# EAGLE design traxmod-pic32-0.7.0 (EAGLE 4.09)
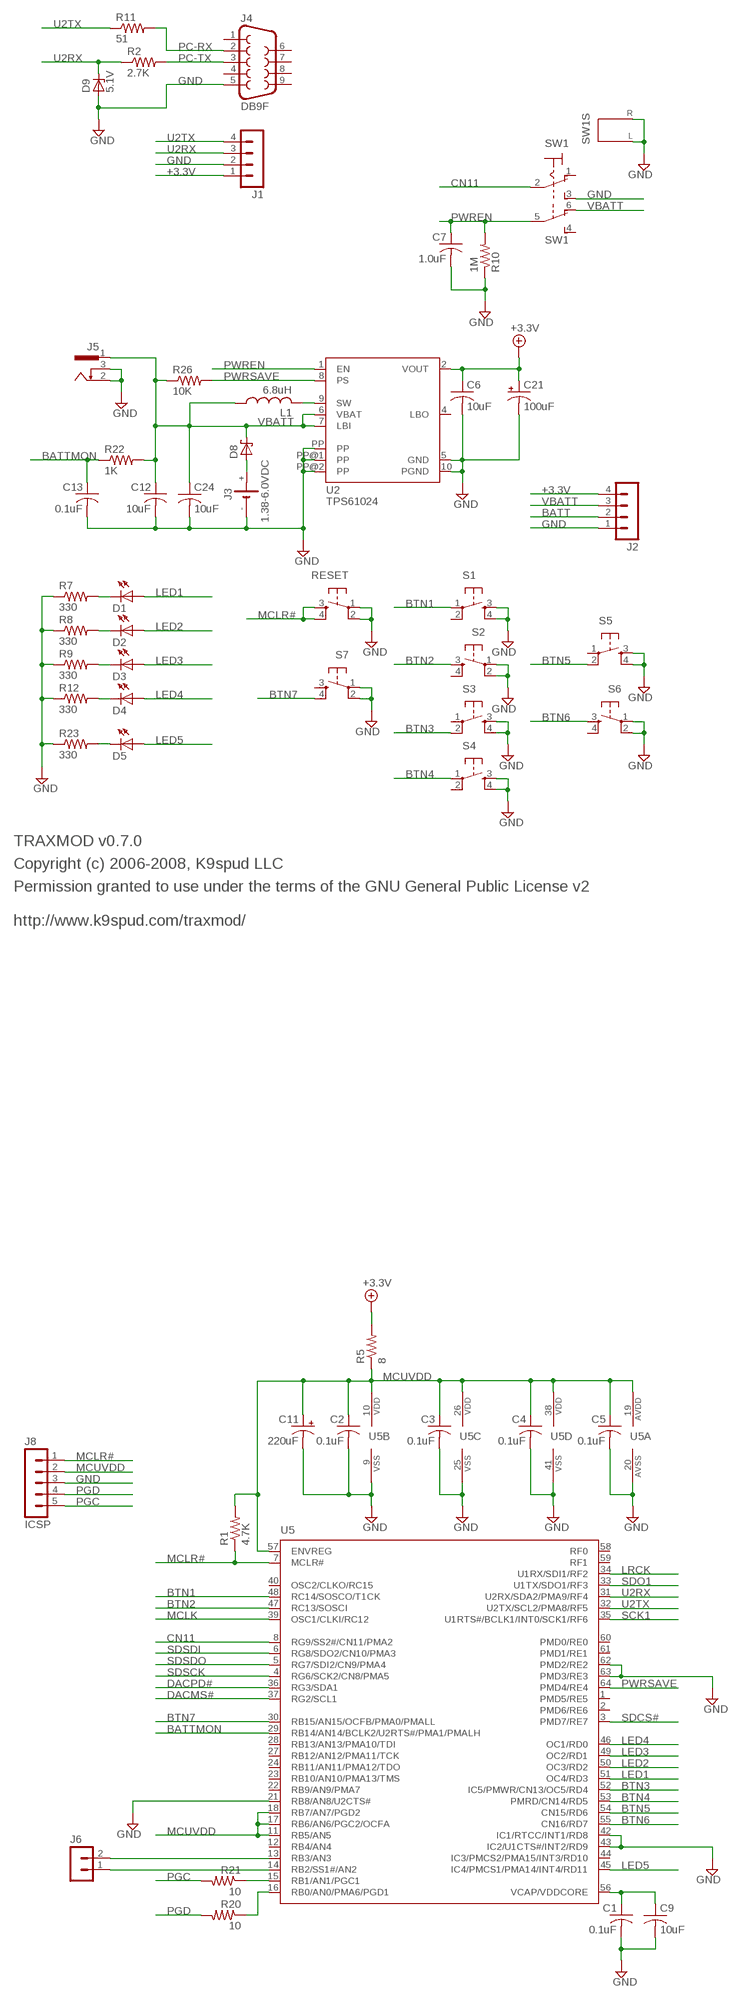
[diagram p0: schematic, sheet 1, part 1 of 2]
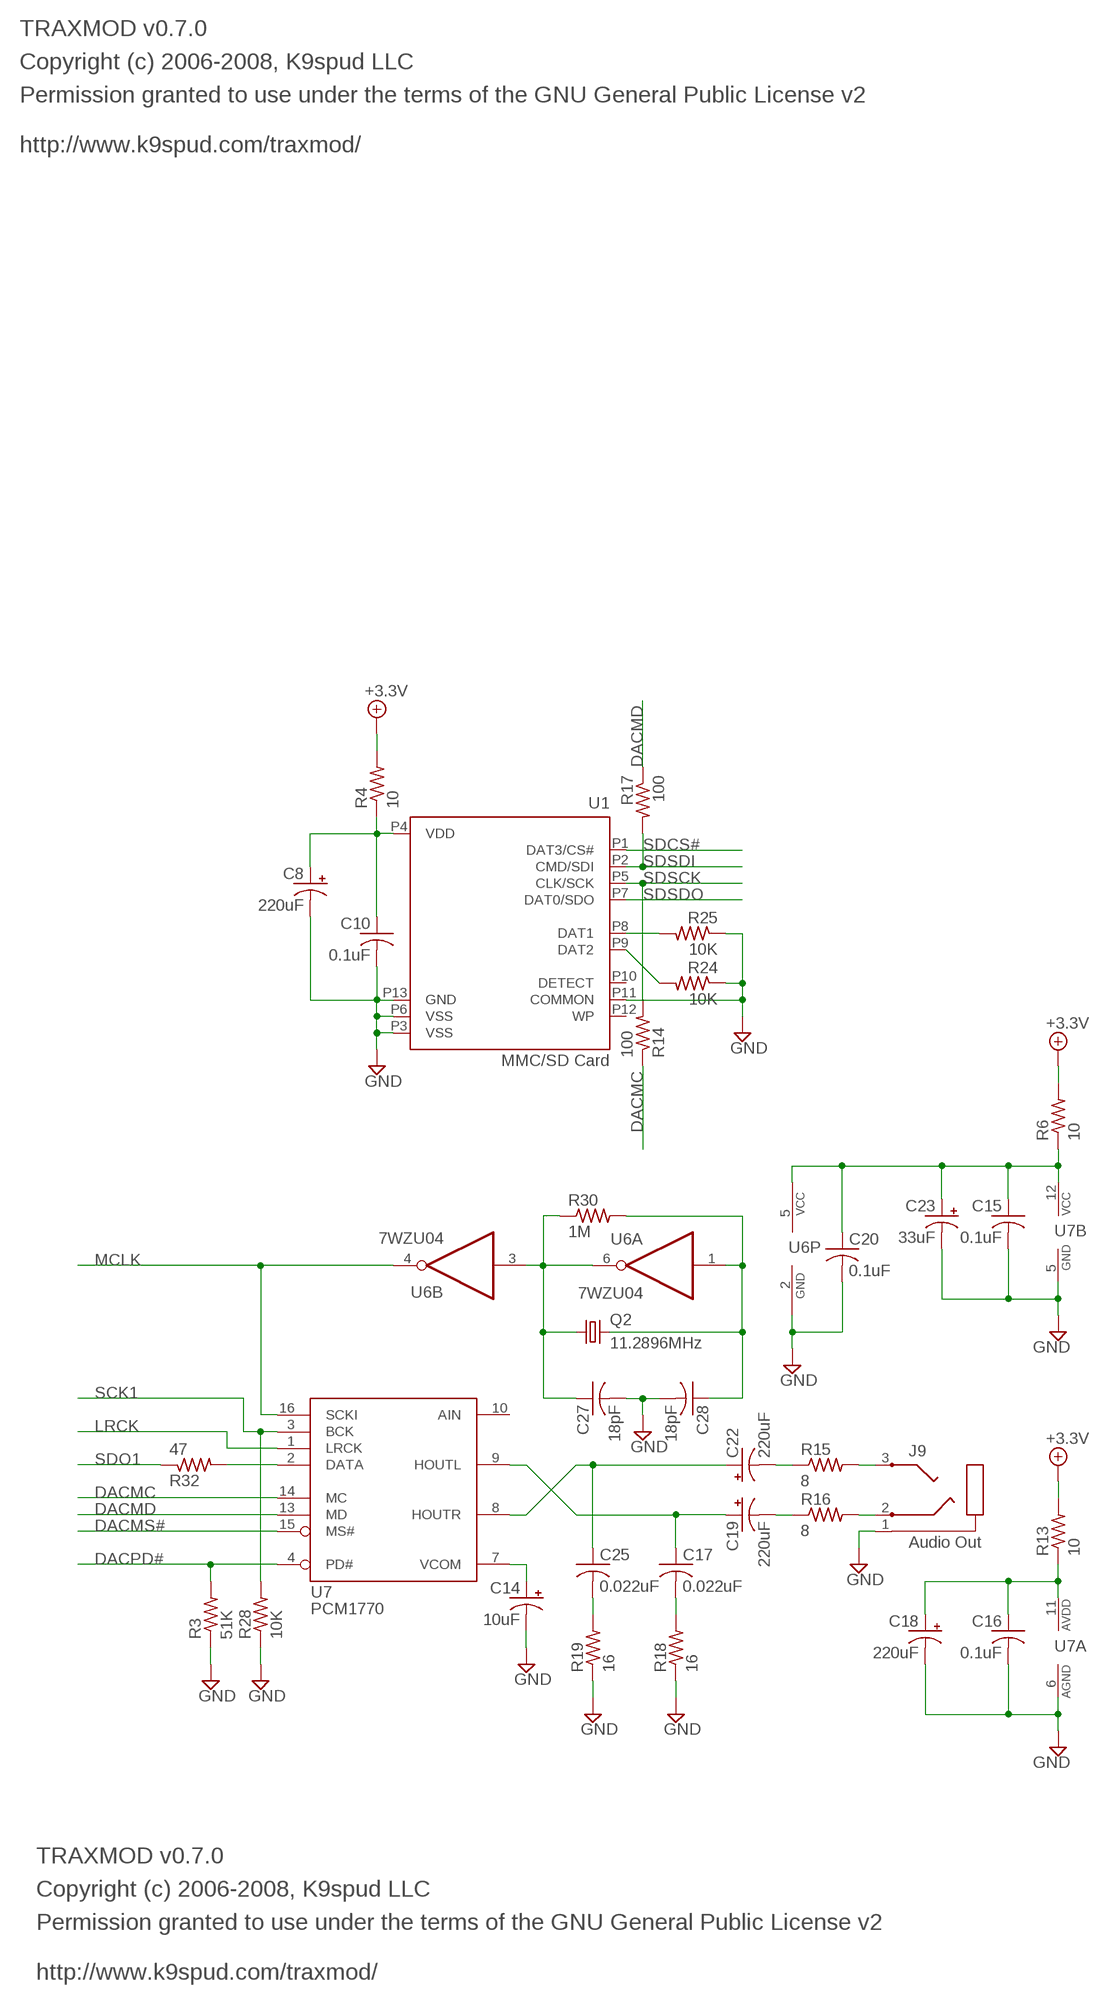
[diagram p1: schematic, sheet 1, part 2 of 2]

## Parts
C1  0.1uF  C-USC0603  [C0603]
C2  0.1uF  C-USC0603  [C0603]
C3  0.1uF  C-USC0603  [C0603]
C4  0.1uF  C-USC0603  [C0603]
C5  0.1uF  C-USC0603  [C0603]
C6  10uF  C-USC1206  [C1206]
C7  1.0uF  C-USC0603  [C0603]
C8  220uF  CPOL-USE3.5-8  [E3.5-8]
C9  10uF  C-USC1206  [C1206]
C10  0.1uF  C-USC0603  [C0603]
C11  220uF  CPOL-USE3.5-8  [E3.5-8]
C12  10uF  C-USC1206  [C1206]
C13  0.1uF  C-USC0603  [C0603]
C14  10uF  CPOL-USE2-5  [E2-5]
C15  0.1uF  C-USC0603  [C0603]
C16  0.1uF  C-USC0603  [C0603]
C17  0.022uF  C-USC0603  [C0603]
C18  220uF  CPOL-USE3.5-8  [E3.5-8]
C19  220uF  CPOL-USE3.5-8  [E3.5-8]
C20  0.1uF  C-USC0603  [C0603]
C21  100uF  CPOL-USD  [C7343]
C22  220uF  CPOL-USE3.5-8  [E3.5-8]
C23  33uF  CPOL-USE2-5  [E2-5]
C24  10uF  C-USC1206  [C1206]
C25  0.022uF  C-USC0603  [C0603]
C27  18pF  C-USC0603  [C0603]
C28  18pF  C-USC0603  [C0603]
D1  LED3MM  [LED3MM]
D2  LED3MM  [LED3MM]
D3  LED3MM  [LED3MM]
D4  LED3MM  [LED3MM]
D5  LED3MM  [LED3MM]
D8  SCHOTTKY-FYV0704S  [SOT23W]
D9  5.1V  ZENER-DIODESOD80C  [SOD80C]
J1  MA04-1S  [MA04-1S]
J2  MA04-1S  [MA04-1S]
J3  1.38-6.0VDC  12BH423  [12BH423]
J4  DB9F  F09D  [F09D]
J5  PWRJACK-1.3MM  [PWR-13MM]
J6  MA02-1S  [MA02-1S]
J8  ICSP  MA05-1S  [MA05-1S]
J9  Audio Out  3C-STEREO  [3C-3-5MM]
L1  6.8uH  L-US  [SMP3316]
Q2  11.2896MHz  CRYTALTC26H  [TC26H]
R1  4.7K  R-US_R0603  [R0603]
R2  2.7K  R-US_R0603  [R0603]
R3  51K  R-US_R0603  [R0603]
R4  10  R-US_R0603  [R0603]
R5  8  R-US_R0603  [R0603]
R6  10  R-US_R0603  [R0603]
R7  330  R-US_R0603  [R0603]
R8  330  R-US_R0603  [R0603]
R9  330  R-US_R0603  [R0603]
R10  1M  R-US_R0603  [R0603]
R11  51  R-US_R0603  [R0603]
R12  330  R-US_R0603  [R0603]
R13  10  R-US_R0603  [R0603]
R14  100  R-US_R0603  [R0603]
R15  8  R-US_R0603  [R0603]
R16  8  R-US_R0603  [R0603]
R17  100  R-US_R0603  [R0603]
R18  16  R-US_R0603  [R0603]
R19  16  R-US_R0603  [R0603]
R20  10  R-US_R0603  [R0603]
R21  10  R-US_R0603  [R0603]
R22  1K  R-US_R0603  [R0603]
R23  330  R-US_R0603  [R0603]
R24  10K  R-US_R0603  [R0603]
R25  10K  R-US_R0603  [R0603]
R26  10K  R-US_R0603  [R0603]
R28  10K  R-US_R0603  [R0603]
R30  1M  R-US_R0603  [R0603]
R32  47  R-US_R0603  [R0603]
RESET  10-XX  [6X6]
S1  10-XX  [6X6]
S2  10-XX  [6X6]
S3  10-XX  [6X6]
S4  10-XX  [6X6]
S5  10-XX  [6X6]
S6  10-XX  [6X6]
S7  10-XX  [6X6]
SW1  EG2215  [EG2215]
U1  MMC/SD Card  SCDA  [SCDA]
U2  TPS61024  TPS6102X  [QFN10]
U5  PIC32MX340  [TQFP-64]
U6  7WZU04  NC7WZU04  [SC70-6]
U7  PCM1770  [SSOP16]

## Nets
+3.3V: C6.1 C21.+ J1.1 J2.4 R4.2 R5.2 R6.2 R13.2 U2.2(VOUT)
BATT: D8.1(A) J2.2 J3.+
BATTMON: C13.1 R22.1 U5.29(RB14/AN14/BCLK2/U2RTS#/PMA1/PMALH)
BTN1: S1.1(P) U5.48(RC14/SOSCO/T1CK)
BTN2: S2.3(S) U5.47(RC13/SOSCI)
BTN3: S3.2(P1) U5.52(IC5/PMWR/CN13/OC5/RD4)
BTN4: S4.1(P) U5.53(PMRD/CN14/RD5)
BTN5: S5.2(P1) U5.54(CN15/RD6)
BTN6: S6.3(S) U5.55(CN16/RD7)
BTN7: S7.4(S1) U5.30(RB15/AN15/OCFB/PMA0/PMALL)
CN11: SW1.2(P) U5.8(RG9/SS2#/CN11/PMA2)
DACAVDD: C16.1 C18.+ R13.1 U7.11(AVDD)
DACMC: R14.1 U7.14(MC)
DACMD: R17.1 U7.13(MD)
DACMS#: U5.37(RG2/SCL1) U7.15(MS#)
DACPD#: R3.2 U5.36(RG3/SDA1) U7.4(PD#)
DACVDD: C15.1 C20.1 C23.+ R6.1 U6.5(P:VCC) U7.12(VCC)
DATA: R32.2 U7.2(DATA)
GND: C1.2 C2.2 C3.2 C4.2 C5.2 C6.2 C7.2 C8.- C9.2 C10.2 C11.- C12.2 C13.2 C14.- C15.2 C16.2 C18.- C20.2 C21.- C23.- C24.2 C27.2 C28.2 D9.A J1.2 J2.1 J3.- J4.5 J5.2 J5.3 J8.3 J9.1 R3.1 R7.1 R8.1 R9.1 R10.1 R12.1 R18.1 R19.1 R23.1 R24.1 R25.1 R28.1 RESET.1(P) RESET.2(P1) S1.3(S) S1.4(S1) S2.1(P) S2.2(P1) S3.3(S) S3.4(S1) S4.3(S) S4.4(S1) S5.3(S) S5.4(S1) S6.1(P) S6.2(P1) S7.1(P) S7.2(P1) SW1.3(S) SW1.7(S:S) SW1.8(S:S) U1.P3(VSS) U1.P6(VSS) U1.P11(COMMON) U1.P13(GND) U2.5(GND) U2.10(PGND) U2.PP U2.PP@1(PP) U2.PP@2(PP) U5.9(VSS) U5.20(AVSS) U5.21(RB8/AN8/U2CTS#) U5.25(VSS) U5.41(VSS) U5.42(IC1/RTCC/INT1/RD8) U5.43(IC2/U1CTS#/INT2/RD9) U5.62(PMD2/RE2) U5.63(PMD3/RE3) U6.2(P:GND) U7.5(GND) U7.6(AGND)
HOUTL: C22.+ C25.1 U7.8(HOUTR)
HOUTR: C17.1 C19.+ U7.9(HOUTL)
LED1: D1.A U5.51(OC4/RD3)
LED2: D2.A U5.50(OC3/RD2)
LED3: D3.A U5.49(OC2/RD1)
LED4: D4.A U5.46(OC1/RD0)
LED5: D5.A U5.45(IC4/PMCS1/PMA14/INT4/RD11)
LRCK: U5.34(U1RX/SDI1/RF2) U7.1(LRCK)
MCLK: U5.39(OSC1/CLKI/RC12) U6.4(B:O) U7.16(SCKI)
MCLR#: J8.1 R1.1 RESET.3(S) RESET.4(S1) U5.7(MCLR#)
MCUVDD: C2.1 C3.1 C4.1 C5.1 C11.+ J8.2 R1.2 R5.1 U5.10(VDD) U5.11(RB5/AN5) U5.17(RB6/AN6/PGC2/OCFA) U5.18(RB7/AN7/PGD2) U5.19(AVDD) U5.26(VDD) U5.38(VDD) U5.57(ENVREG)
N$1: D1.K(C) R7.2
N$2: D5.K(C) R23.2
N$3: D2.K(C) R8.2
N$4: D3.K(C) R9.2
N$5: L1.2 U2.9(SW)
N$6: D4.K(C) R12.2
N$8: R20.1 U5.16(RB0/AN0/PMA6/PGD1)
N$10: R21.1 U5.15(RB1/AN1/PGC1)
N$13: R24.2 U1.P9(DAT2)
N$14: R25.2 U1.P8(DAT1)
N$15: C27.1 Q2.1 R30.1 U6.3(B:I) U6.6(A:O)
N$21: C28.1 Q2.2 R30.2 U6.1(A:I)
N$28: C25.2 R19.2
N$30: C17.2 R18.2
N$31: C22.- R15.1
N$34: C19.- R16.1
N$35: J9.3 R15.2
N$36: J9.2 R16.2
PC-RX: J4.2 R11.2
PC-TX: J4.3 R2.2
PGC: J8.5 R21.2
PGD: J8.4 R20.2
PWREN: C7.1 R10.2 SW1.5(P) U2.1(EN)
PWRSAVE: R26.2 U2.8(PS) U5.64(PMD4/RE4)
RB3: J6.2 U5.13(RB3/AN3)
SCK1: R28.2 U5.35(U1RTS#/BCLK1/INT0/SCK1/RF6) U7.3(BCK)
SDCS#: U1.P1(DAT3/CS#) U5.3(PMD7/RE7)
SDO1: R32.1 U5.33(U1TX/SDO1/RF3)
SDSCK: R14.2 U1.P5(CLK/SCK) U5.4(RG6/SCK2/CN8/PMA5)
SDSDI: R17.2 U1.P2(CMD/SDI) U5.6(RG8/SDO2/CN10/PMA3)
SDSDO: U1.P7(DAT0/SDO) U5.5(RG7/SDI2/CN9/PMA4)
SDVDD: C8.+ C10.1 R4.1 U1.P4(VDD)
SS1#: J6.1 U5.14(RB2/SS1#/AN2)
U2RX: D9.C J1.3 R2.1 U5.31(U2RX/SDA2/PMA9/RF4)
U2TX: J1.4 R11.1 U5.32(U2TX/SCL2/PMA8/RF5)
VBATT: C12.1 C24.1 D8.3(C) J2.3 J5.1 L1.1 R22.2 R26.1 SW1.6(O) U2.6(VBAT) U2.7(LBI)
VCOM: C14.+ U7.7(VCOM)
VDDCORE: C1.1 C9.1 U5.56(VCAP/VDDCORE)
Unconnected: J4.1 J4.4 J4.6 J4.7 J4.8 J4.9 S1.2(P1) S2.4(S1) S3.1(P) S4.2(P1) S5.1(P) S6.4(S1) S7.3(S) SW1.1(O) SW1.4(S) U1.P10(DETECT) U1.P12(WP) U2.4(LBO) U5.1(PMD5/RE5) U5.2(PMD6/RE6) U5.12(RB4/AN4) U5.22(RB9/AN9/PMA7) U5.23(RB10/AN10/PMA13/TMS) U5.24(RB11/AN11/PMA12/TDO) U5.27(RB12/AN12/PMA11/TCK) U5.28(RB13/AN13/PMA10/TDI) U5.40(OSC2/CLKO/RC15) U5.44(IC3/PMCS2/PMA15/INT3/RD10) U5.58(RF0) U5.59(RF1) U5.60(PMD0/RE0) U5.61(PMD1/RE1) U7.10(AIN)

## Notes on the sheet
- TRAXMOD v0.7.0
- Copyright (c) 2006-2008, K9spud LLC
- Permission granted to use under the terms of the GNU General Public License v2
- http://www.k9spud.com/traxmod/
- TRAXMOD v0.7.0
- Copyright (c) 2006-2008, K9spud LLC
- Permission granted to use under the terms of the GNU General Public License v2
- http://www.k9spud.com/traxmod/
- TRAXMOD v0.7.0
- Copyright (c) 2006-2008, K9spud LLC
- Permission granted to use under the terms of the GNU General Public License v2
- http://www.k9spud.com/traxmod/

## Library data of the parts
C1-C7 C9 C10 C12 C13 C15-C17 C20 C24 C25 C27 C28 = rcl:C-US
C8 C11 C14 C18 C19 C21-C23 = rcl:CPOL-US
D1-D5 = led:LED
D8 = diode:SCHOTTKY
D9 = diode:ZENER-DIODE: Z-Diode
J1 J2 = headers:MA04-1
J3 = battery:12BH423: 2xAAA battery holder.
J4 = con-subd:F09
J5 = con-power:PWRJACK
J6 = headers:MA02-1
J8 = headers:MA05-1
J9 = audiocon:3C-STEREO
L1 = rcl:L-US: Inductor
Q2 = crystal:CRYTAL: CRYSTAL
R1-R26 R28 R30 R32 = rcl:R-US_
RESET S1-S7 = button:10-XX
SW1 = switch:EG2215
U1 = sdio:SCDA: ALPS SCDA SD Card Socket
U2 = powersupply:TPS6102X
U5 = microchip:PIC32MX340: PIC32MX 32-bit MIPS microcontroller
U6 = logic:NC7WZU04: Unbuffered dual inverter tinylogic.
U7 = audio:PCM1770: PCM1770 Texas Instruments/Burr-Brown Stereo DAC with Headphone Amplifier.

## Board
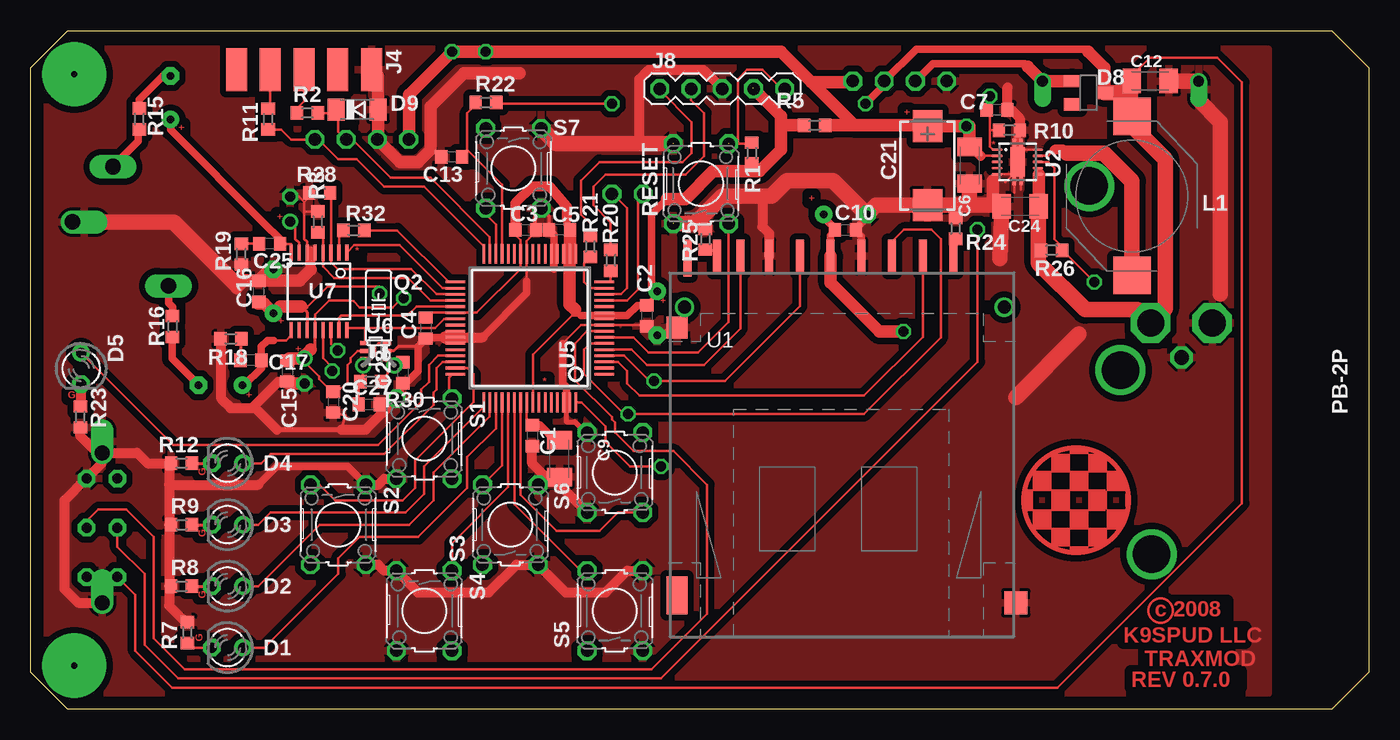
[diagram p2: board, top side]
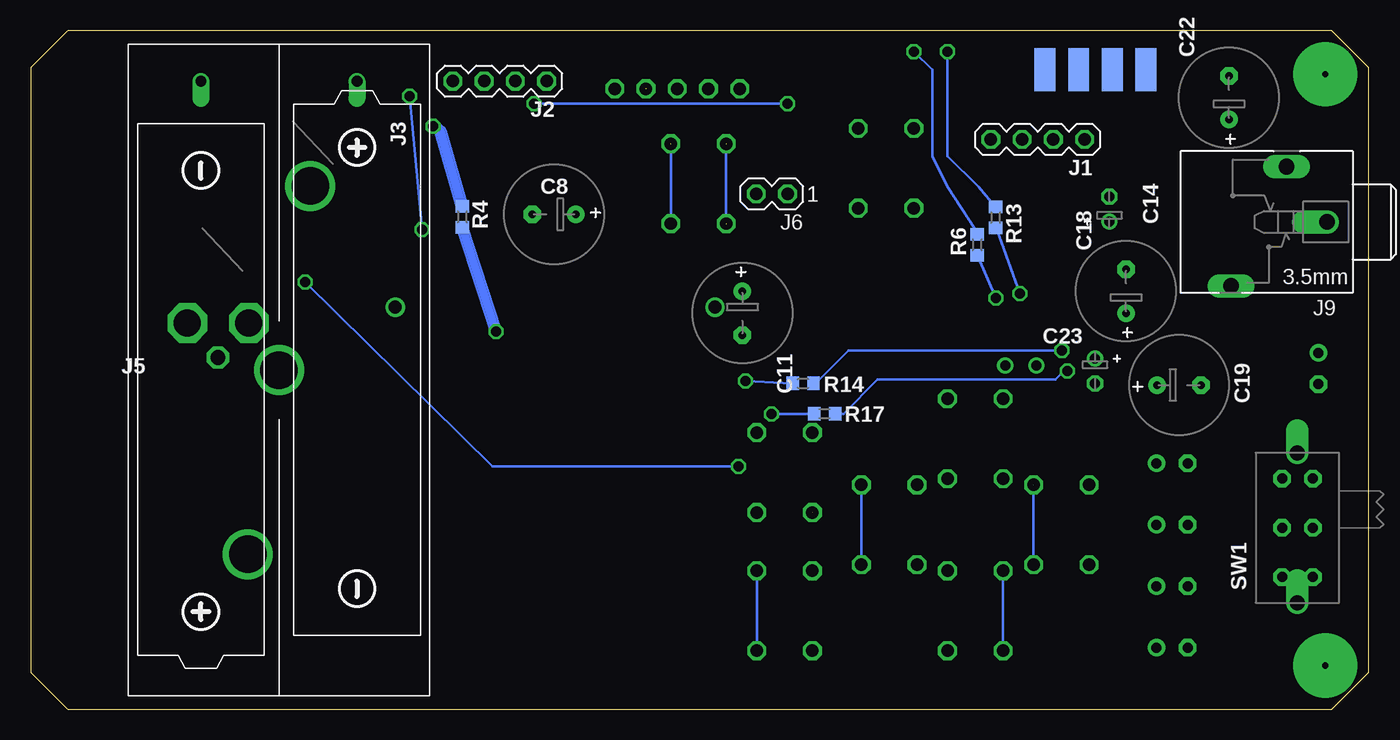
[diagram p3: board, bottom side, seen from below]

Size 108.81 x 55.19 mm. Coordinates in mm from the lower left corner, seen from the top.
Copper layers used: Top, Bottom

### Footprints (pad centres in the part's own frame; a part is rotated, then mirrored left to right if it is on the bottom)
C0603 = smd 1 x 1.1: 1 -0.85,0; 2 0.85,0
C1206 = smd 1.5 x 2: 1 -1.5,0; 2 1.5,0
E3.5-8 = drill 0.61 pad 1.422 round: + -1.778,0 | drill 0.61 pad 1.422 octagon: - 1.778,0
E2-5 = drill 0.813 pad 1.27 round: + -1.016,0 | drill 0.813 pad 1.27 octagon: - 1.016,0
C7343 = smd 2.6 x 2.4: + 3.2,0; - -3.2,0
LED3MM = drill 0.813 pad 1.422 round: A -1.27,0 | drill 0.813 pad 1.422 octagon: K 1.27,0
SOT23W = smd 1 x 1.4: 1 -0.95,-1.303; 2 0.95,-1.303; 3 0,1.303
SOD80C = smd 1.4 x 1.8: A 1.7,0; C -1.7,0
MA04-1S = drill 1.016 octagon: 1 -3.81,0; 2 -1.27,0; 3 1.27,0; 4 3.81,0
12BH423 = drill 0.889 offset: + -23.495,6.35; - -23.495,-6.35 | drill 3.048 round: M 0,0; M2 -14.986,2.54; M3 14.986,-2.54
F09D = smd 1.7 x 3.5: 1 -5.486,-6.045; 2 -2.743,-6.045; 3 0,-6.045; 4 2.743,-6.045; 5 5.486,-6.045 | smd 1.7 x 3.5 bottom: 6 -4.115,-6.045; 7 -1.372,-6.045; 8 1.372,-6.045; 9 4.115,-6.045
PWR-13MM = drill 2.2 octagon: 1 0,5.92; 2 0,0.92 | drill 1.2 octagon: 3 2.8,3.42
MA02-1S = drill 1.016 octagon: 1 -1.27,0; 2 1.27,0
MA05-1S = drill 1.016 octagon: 1 -5.08,0; 2 -2.54,0; 3 0,0; 4 2.54,0; 5 5.08,0
3C-3-5MM = drill 1.27 offset: 1 -5.004,0 | drill 1.27 long: 2 2.819,5.207; 3 -1.702,-4.496
SMP3316 = smd 3.05 x 3.05: 1 -6.47,0; 2 6.47,0
TC26H = drill 0.813 round: 1 -1.27,0; 2 1.27,0
R0603 = smd 1 x 1.1: 1 -0.85,0; 2 0.85,0
6X6 = drill 1.016 octagon: 1 -3.251,2.261; 2 3.251,2.261; 3 -3.251,-2.261; 4 3.251,-2.261
EG2215 = drill 0.813 pad 1.422 octagon: 1 -4,-1.25; 2 0,-1.25; 3 4,-1.25; 4 4,1.25; 5 0,1.25; 6 -4,1.25 | drill 1.213 pad 1.27 offset: 7 -6.1,0; 8 6.1,0
SCDA = drill 1.05 round: B1 -12.5,11; B2 13.5,11 | smd 0.65 x 2.7: P1 6.875,15.15; P2 4.375,15.15; P3 1.875,15.15; P4 -0.625,15.15; P5 -3.125,15.15; P6 -5.625,15.15; P7 -7.95,15.15; P8 -9.85,15.15; P9 9.375,15.15 | smd 0.65 x 3: P10 -12.275,15 | smd 1.7 x 1.8: P11 -13.1,9.35 | smd 1.7 x 3.1: P12 -13.1,-12.45 | smd 1.9 x 1.9: P13 14.45,-13.05
QFN10 = smd 0.21 x 0.85: 1 -1,-1.663; 2 -0.5,-1.663; 3 0,-1.663; 4 0.5,-1.663; 5 1,-1.663; 6 1,1.663; 7 0.5,1.663; 8 0,1.663; 9 -0.5,1.663; 10 -1,1.663 | smd 2.4 x 1.2: PP 0,0 | smd 3.8 x 0.28: PP@1 0,0.275; PP@2 0,-0.275
TQFP-64 = smd 0.21 x 1.6: 1 -3.75,-6.05; 2 -3.25,-6.05; 3 -2.75,-6.05; 4 -2.25,-6.05; 5 -1.75,-6.05; 6 -1.25,-6.05; 7 -0.75,-6.05; 8 -0.25,-6.05; 9 0.25,-6.05; 10 0.75,-6.05; 11 1.25,-6.05; 12 1.75,-6.05; 13 2.25,-6.05; 14 2.75,-6.05; 15 3.25,-6.05; 16 3.75,-6.05; 33 3.75,6.05; 34 3.25,6.05; 35 2.75,6.05; 36 2.25,6.05; 37 1.75,6.05; 38 1.25,6.05; 39 0.75,6.05; 40 0.25,6.05; 41 -0.25,6.05; 42 -0.75,6.05; 43 -1.25,6.05; 44 -1.75,6.05; 45 -2.25,6.05; 46 -2.75,6.05; 47 -3.25,6.05; 48 -3.75,6.05 | smd 1.6 x 0.21: 17 6.05,-3.75; 18 6.05,-3.25; 19 6.05,-2.75; 20 6.05,-2.25; 21 6.05,-1.75; 22 6.05,-1.25; 23 6.05,-0.75; 24 6.05,-0.25; 25 6.05,0.25; 26 6.05,0.75; 27 6.05,1.25; 28 6.05,1.75; 29 6.05,2.25; 30 6.05,2.75; 31 6.05,3.25; 32 6.05,3.75; 49 -6.05,3.75; 50 -6.05,3.25; 51 -6.05,2.75; 52 -6.05,2.25; 53 -6.05,1.75; 54 -6.05,1.25; 55 -6.05,0.75; 56 -6.05,0.25; 57 -6.05,-0.25; 58 -6.05,-0.75; 59 -6.05,-1.25; 60 -6.05,-1.75; 61 -6.05,-2.25; 62 -6.05,-2.75; 63 -6.05,-3.25; 64 -6.05,-3.75
SC70-6 = smd 0.35 x 0.8: 1 -0.65,-0.85; 2 0,-0.85; 3 0.65,-0.85; 4 0.65,0.85; 5 0,0.85; 6 -0.65,0.85
SSOP16 = smd 0.26 x 1.3: 1 -2.275,-3.15; 2 -1.625,-3.15; 3 -0.975,-3.15; 4 -0.325,-3.15; 5 0.325,-3.15; 6 0.975,-3.15; 7 1.625,-3.15; 8 2.275,-3.15; 9 2.275,3.15; 10 1.625,3.15; 11 0.975,3.15; 12 0.325,3.15; 13 -0.325,3.15; 14 -0.975,3.15; 15 -1.625,3.15; 16 -2.275,3.15

### Placement (x,y rotation side)
C1  40.77,22.25 270 top
C2  50.1,32 270 top
C3  40.25,39 0 top
C4  32.11,31 270 top
C5  43,39 180 top
C6  76.34,44.25 270 top
C7  78.58,48.76 0 top
C8  66.25,40.25 180 bottom
C9  43,20.38 270 top
C10  66.25,39 0 top
C11  50.93,32.21 270 bottom
C12  91.04,51.09 0 top
C13  34.23,44.91 180 top
C14  21.09,40.67 90 bottom
C15  20.85,27.5 270 top
C16  18.55,34 90 top
C17  17.91,28.38 180 top
C18  19.74,34 90 bottom
C19  15.43,26.37 0 bottom
C20  24.59,24.98 270 top
C21  72.93,44.21 90 top
C22  11.37,49.73 90 bottom
C23  22.26,27.5 270 bottom
C24  80.45,40.9 180 top
C25  19.43,37.87 180 top
C27  27.52,24.79 0 top
C28  30.25,27.36 270 top
D1  16,5 180 top
D2  16,10 180 top
D3  16,15 180 top
D4  16,20 180 top
D5  4.09,27.71 270 top
D8  86,50.14 270 top
D9  26.54,48.77 0 top
J1  26.92,46.34 0 bottom
J2  70.67,51.09 0 bottom
J3  88.62,27.58 270 bottom
J4  22.23,58.06 0 top
J5  97,31.41 270 bottom
J6  48.54,41.91 180 bottom
J8  56.23,50.47 180 top
J9  8.39,39.63 180 bottom
L1  89.55,41.75 270 top
PB-2P  [PB-2P]  1,1 0 top
Q2  28.29,27.96 0 top
R1  58.64,45.24 270 top
R2  22.5,48.51 180 top
R3  23.35,39.64 270 top
R4  73.72,40.05 90 bottom
R5  63.76,47.48 0 top
R6  31.84,37.77 90 bottom
R7  12.75,6.23 270 top
R8  12.27,10 0 top
R9  12.27,15 0 top
R10  79.58,47.09 180 top
R11  19.31,48 90 top
R12  12.27,20 0 top
R13  30.34,40 90 bottom
R14  46,26.5 180 bottom
R15  8.83,48.01 270 top
R16  11.54,31.12 90 top
R17  44.25,24.02 180 bottom
R18  16.28,30.12 0 top
R19  17.12,37.01 90 top
R20  47.16,36.51 90 top
R21  45.51,37.63 90 top
R22  37.02,49.34 0 top
R23  4.03,23.77 90 top
R24  75.22,39.1 270 top
R25  54.87,38.23 270 top
R26  83.02,37.34 0 top
R28  23.49,41.98 0 top
R30  27.64,26.65 0 top
R32  26.28,38.94 180 top
RESET  54.51,42.75 90 top
S1  32,22 270 top
S2  25,15 270 top
S3  39,15 90 top
S4  32,8 270 top
S5  47.5,8 90 top
S6  47.5,19.25 90 top
S7  39.25,44 270 top
SW1  5.8,14.75 90 bottom
U1  65.67,21.7 0 top
U2  80.25,44.51 270 top
U5  40.58,31 90 top
U6  28.04,29.14 90 top
U7  23.44,34 180 top

### Tracks (layer width: path | path; a pad name or v marks a point on that pad's centre or on a via)
+3.3V  (via drill 0.81)
  Top 0.203: 77.49,45.01 77.5,45 77.51,45.01 U2.2
  Top 0.254: 77.25,45 77.49,45.01
  Top 0.305: J1.1 30.75,46.32 30.75,46.25
  Top 0.813: C6.1 76.75,45.5 77.25,45
  Top 1.016: 76.34,47.34 C6.1 | 76.34,47.34 76.25,47.25 v76.09,47.41 C21.+ 72.84,47.5 67,47.5 | 76.34,47.34 76.34,47.41 | 30.75,46.25 30.75,50 v34.25,53.5 v37,53.5 61,53.5 63.5,51 | 63.5,51 67,47.5 | J2.4 66.77,51 63.5,51 | R5.2 64.62,47.5 67,47.5
  Bottom 0.203: R6.2 32,39 34.25,42.5 35.5,45 35.5,52 v37,53.5 | R13.2 30.5,41 31.75,42.5 34.25,45 v34.25,53.5
  Bottom 1.016: R4.2 75.47,46.97 75.91,47.41 v76.09,47.41
BATT
  Top 0.61: 81.09,52.25 80.84,52.5 73.35,52.5 J2.2
  Top 1.016: 82.27,51.02 82.25,51 | 82.27,51.02 J3.+ 81.09,52.25 | D8.1 82.34,51.09 82.27,51.02
BATTMON
  Top 0.203: U5.29 38.33,42.67 35.5,45.5 | 35.5,45.5 35.5,48.5 36,49 36,49.17 R22.1 | C13.1 35.5,45.33 35.5,45.5
BTN1
  Top 0.203: U5.48 34.25,27.25 34,27 34,25.5 S1.1
BTN2
  Top 0.203: S2.3 23.5,18.25 24.75,17 30.25,17 31.25,18 31.25,20.25 36,25 36,27.25 35.5,27.75 U5.47
BTN3
  Top 0.203: S3.2 38.33,19.83 U5.52
BTN4
  Top 0.203: U5.53 38.83,18.08 34.25,13.5 34.26,13.49 S4.1
BTN5
  Top 0.203: S5.2 44.75,11.25 | U5.54 39.33,16.67 44.75,11.25 | 44.75,11.25
BTN6
  Top 0.203: S6.3 47.75,16 46.25,14.5 42.75,14.5 39.83,17.42 U5.55
BTN7
  Top 0.203: S7.4 36.99,40.26 37.83,39.42 U5.30
CN11
  Top 0.203: U5.8 45.25,30.75 44.25,29.75 44.25,26.75 47.25,23.75 47.25,23.56 47.5,23.31 47.5,22.5 49,21 52.25,21 55,18.25 55,7.75 50.5,3.25 12.5,3.25 10,5.75 10,14 7.75,16.25 5.5,16.25 4.55,15.3 SW1.2
DACAVDD  (via drill 0.81)
  Top 0.203: 22.46,32.72 24.12,34.38 28.38,34.38 v28.38,33.81
  Top 0.254: U7.11 22.46,32.28 22.25,32.5 22.46,32.72 22.29,32.72 22.25,32.75 22,32.75
  Top 1.016: C16.1 18.5,33.1 18.5,33 18.96,33 C18.+ 20.27,32.75 22,32.75
  Bottom 0.203: R13.1 30.25,39 v28.38,33.81
DACMC  (via drill 0.81)
  Top 0.203: U7.14 24.41,29.77 24.44,29.75 24.44,29.69 v24.94,29.19
  Bottom 0.203: R14.1 45,26.5 42.31,29.19 v24.94,29.19
DACMD  (via drill 0.81)
  Top 0.203: v24.5,27.5 24.5,27.81 23.77,28.55 U7.13
  Bottom 0.203: R17.1 42.73,24.02 39.94,26.81 25.5,26.81 24.81,27.5 v24.5,27.5
DACMS#
  Top 0.203: U7.15 25.07,31.82 25.25,32 30.62,32 31.38,32.75 U5.37
DACPD#
  Top 0.203: R3.2 23.71,38.79 23.77,38.73 U7.4 23.77,35.98 24.69,35.06 30.69,35.06 32.5,33.25 U5.36
DACVDD  (via drill 0.81)
  Top 0.203: U7.12 23.11,32.11 24.25,33.25 26,33.25 26.25,33.19 26.75,32.69 29.44,32.69 30.19,33.44 v30.31,33.44 | U6.5 26.57,29.14 26,28.56 26,28.25 25.75,28 25.75,26.62 24.88,25.75 24.75,25.75 24.67,25.75 C20.1 | 24.59,25.72 23.44,26.88 23.44,27.06 22.26,28.24 C23.+
  Top 0.254: 22.75,29.25 23,29.25 23.11,29.36 U7.12
  Top 0.276: C20.1 24.67,25.83 24.75,25.75 24.72,25.72 24.59,25.72
  Top 1.016: C15.1 21.02,28.52 C23.+ 22.26,28.76 22.75,29.25
  Bottom 0.203: R6.1 31.75,36.75 v30.31,33.44
DATA
  Top 0.203: R32.2 25.07,38.56 U7.2
GND  (4 unrouted)
  Top 0.203: 22.25,40.5 22.25,38.25 22.46,38.03 U7.6 22.65,37.15 22.75,37.25 22.85,37.15 U7.5 | 22.25,40.5 22.25,41.25 | R3.1 22.26,40.49 22.25,40.5 | C14.- 21.81,41.69 22.25,41.25 | 40.33,34.83 U5.25 40.33,38.08 41,38.75 41,39.1 | C27.2 29.29,24.79 S1.3 | S1.3 | C28.2 30.25,25.75 S1.3 | C24.2 78.58,41.17 78.75,41 | 44,46 44.16,45.84 | 17.35,34.85 17.35,34.9 17.12,35.13 R19.1 | 16.75,34.5 16.75,34.25 | C20.2 25.59,23.91 25.25,22.75 | C13.2 32.79,45.5 32.5,45.5 | 79.99,43.51 80,43.5 80,44.5 79.99,44.51 U2.PP@2 | U2.10 80.51,45.51 80.5,45.5 80.5,44.75 80.53,44.73 U2.PP@1 | 78.25,43 78.5,43 78.59,43.09 U2.5 79.86,43.51 79.88,43.5 | R28.1 22.64,41.64 22.25,41.25 | R25.1 54.87,39.13 54.5,39.5 54,39.5 | 50.5,31 50.25,31.25 U5.9 44.75,31.25 43.25,29.75 | 43.56,24.5 43.5,24.56 43.5,24.78 U5.62 43.34,24.94 43.82,24.94 U5.63 | 42.56,35.81 42.5,35.75 42.33,35.92 U5.21 42.7,37.05 42.75,37 42.8,37.05 U5.20 | 35,30.25 U5.42 34.53,30.03 34.5,30 34.53,29.97 U5.43 | U5.41 34.53,30.28 34.5,30.25 | 79.99,43.51 80,43.51 80,42 | 79.99,43.51 80.5,43.51 80.5,42.25 | 79.99,43.51 79.89,43.51 79.88,43.5 | 79.88,43.5 79.25,42.88
  Top 0.254: U6.2 29.51,29.14 29.88,29.5 31.5,29.5
  Top 0.305: C3.2 41,39.1 41,40.24 S7.2 | C5.2 42.15,40.1 41.75,40.5 | 43.56,24.5 43.5,24.5 43.5,24.38 43.56,24.31
  Top 0.406: 20,22.75 25.25,22.75 | U1.P11 52.05,31.05 51.43,30.43 C11.- 50.93,30.57 50.5,31 50.35,31.15 C2.2 | S6.2 45.12,22.5 44.25,23.38 43.56,23.38 43.56,24.31
  Top 0.61: U1.P3 67.54,38.46 67.1,38.9 C10.2 67.1,39.1 68.03,40.03 C8.- | C28.2 30.52,26.52 31.5,27.5 31.5,29.5 32.11,30.11 C4.2 32.4,30.15 32.5,30.25 33.75,30.25 | S2.1 25.75,19.75 20,19.75 18.5,18.25 | R10.1 80.25,46.91 80.25,44.78 U2.PP@1 | 43.25,29.75 43.25,26.5 43.56,26.19 43.56,24.5 | C5.2 42.56,38.59 42.56,35.81 | 40.33,34.83 40.33,33.83 36.75,30.25
  Top 0.813: S1.3 27.25,22.75 25.25,22.75 | S1.4 28.75,18.75 28.25,18.25 S2.1 | S2.2 28.25,11.75 28.75,11.25 S4.3 31.49,9.5 37.25,9.5 39.5,11.75 S3.3 43.51,9.5 46.75,9.5 48.5,11.25 S5.4 | S3.4 | S3.4 | 41.88,18.88 C9.2 42.75,18.5 S6.1 | S3.4 41.88,18.88 | C1.2 40.77,19.98 41.88,18.88 | C15.2 20.15,26.65 18,24.5 | 18,24.5 16.25,24.5 15.5,25.25 15.5,30.25 | 11.25,15 11.25,10 | 11.25,18.25 11.25,15 | 11.25,18.25 11.25,19.83 R12.1 9.5,20 8.65,20.85 SW1.8 | 11.25,10 11.25,8.42 12.67,7 12.75,7 R7.1 | 11.25,10 R8.1 | 11.25,15 R9.1 | J8.3 54.7,52 50.25,52 49.5,51.25 49.5,46 | RESET.1 | U1.P6 60.04,38.71 59.5,39.25 59.5,41.75 | 22.75,35.75 22.75,37.25 | C16.2 18.55,34.95 18.5,35 19.28,35.78 C18.- | 11.25,18.25 18.5,18.25 | SW1.8 5.75,20.8 5.75,19.95 SW1.3 4.5,18.75 2.75,17 2.75,9.75 3.85,8.65 SW1.7 | 20,22.75 18.25,24.5 18,24.5 | R10.1 80.43,48.07 79.74,48.76 C7.2 79.42,50.58 | J2.1 74.64,51.25 | R23.1 4.03,22.22 5.4,20.85 SW1.8 | 35,30.25 36.75,30.25
  Top 1.016: C24.2 78.25,41.73 78.25,43 | 76.34,42.66 C6.2 | 73,41 C21.- | J4.5 28.25,51.48 D9.A 28.25,48.76 28.25,46.4 J1.2 30.03,44.5 31.5,44.5 32.5,45.5 32.5,49 35.25,51.75 39.75,51.75 | 16.75,34.25 17.35,34.85 C16.2 21.85,34.85 22.75,35.75 | C23.- 21.02,26.48 C15.2 | 33.75,30.25 34.5,30.25 U5.42
  Top 1.27: 96.75,33.75 96.75,47.75 94.97,49.53 J3.- 94.97,51.03 | 94.97,51.03 95,51 | C12.2 94.91,51.09 94.97,51.03 | 80.11,25.36 85.25,30.5 | C24.2 78.83,36.67 | 73,41 76.25,41 | 76.25,41 78.75,41 | 76.34,42.66 76.34,41.09 76.25,41 | 68,40.25 C8.- | C21.- 68.75,41 68,40.25 | S7.1 42.76,46 44,46 49.5,46 RESET.2 | 68,40.25 65.25,43 61.5,43 60.25,41.75 59.5,41.75 56.25,41.75 54,39.5 RESET.1 | J9.1 11.62,39.63 16.75,34.5
  Bottom 0.203: S2.2 S2.1 | S4.4 29.74,4.76 S4.3 | S6.1 | S3.3 S3.4 | RESET.1 RESET.2 | S5.4 S5.3
  pour Top (isolate 0.508, rank 4): 1.3,53.7 100.64,53.7 100.64,1.3 1.3,1.3
HOUTL
  Top 0.203: U7.8 21.16,37.84 20.34,37.84 20.28,37.78 | 20.28,37.78 20.25,37.75 | 20.28,37.78 C25.1
  Top 0.61: C22.+ 11.37,47.13 19,39.5 20.28,38.22 C25.1
HOUTR
  Top 0.203: U7.9 21.16,30.41 20.75,30 19.75,30
  Top 0.61: C19.+ 17.37,26.37 18.76,27.76 C17.1 18.76,28.49 18.75,28.5 18.75,29.5 19.25,30 19.75,30
LED1
  Top 0.203: U5.51 37.83,22.83 35.5,20.5 35.5,18 31.5,14 26.75,14 25,12.25 25,11 19,5 D1.A 17.25,5
LED2
  Top 0.203: U5.50 37.33,23.83 32.75,19.25 32.75,17 30.75,15 23.5,15 18.5,10 D2.A
LED3
  Top 0.203: U5.49 36.83,24.58 32,19.75 32,17.5 30.5,16 19.5,16 18.5,15 D3.A
LED4
  Top 0.203: U5.46 33.5,28.25 33,27.75 33,26 32.75,25.75 32.75,24.75 28.75,20.75 19.5,20.75 18.75,20 D4.A
LED5
  Top 0.203: U5.45 33.12,28.75 32.38,28 32.38,26.62 31.75,26 31.75,25 28.25,21.5 11.57,21.5 D5.A
LRCK
  Top 0.203: U5.34 33.5,34.25 30,37.75 26.32,37.75 U7.1
MCLK
  Top 0.203: U5.39 33.62,31.75 32.88,31 27.25,31 | U7.16 25.86,31 27.25,31 | U6.4 27.19,31 27.25,31
MCLR#  (2 unrouted)
  Top 0.203: U5.7 49,30.25 50.25,29 54.25,29 56.75,31.5 56.75,39.25 | R1.1 58.55,46 57.5,46 | J8.1 61.03,50.47 59.5,52 58.25,52 57.5,51.25 57.5,46 | 56.75,39.25 56.75,39.41 | RESET.3 56.75,39.5 56.75,39.25 | RESET.4 57.5,46
  Bottom 0.203: RESET.3 56.75,39.5 56.75,46 RESET.4
MCUVDD  (1 unrouted)
  Top 0.203: C4.1 32.11,32.11 32.25,32.25 U5.38 36.27,32.25 39.83,35.81 U5.26 39.83,38.17 39.5,38.5 39.5,38.65 C3.1 | R1.2 58.64,44.36 59.25,43.75 | C2.1 50.1,33.1 51,34 | U5.57 40.83,28.83 44,32 | U5.17 44.3,37.05 44.25,37 43.75,37 43.8,37.05 U5.18 43.55,37.05 43.5,37 43.45,37.05 U5.19 | 44,32 44.75,32 | 44.25,32.5 44.25,32.25 44,32 | U5.11 46.63,31.87 46.75,31.75 | 46.75,31.75 U5.10 | 48.5,32 47,32 46.75,31.75
  Top 0.61: 51.75,41.5 50.5,40.25 50.5,34.42 C11.+ | C2.1 49.35,32.85 48.5,32 44.75,32 | C5.1 43.85,39.15 43.6,39.4 43.6,39.85
  Top 0.813: 43.6,39.85 43.6,40.9 42.25,42.5 40.75,42.5 39.4,41.15 C3.1
  Top 1.016: 51.75,41.5 53.25,41.5 55.5,43.75 59.25,43.75 61,45.5 61,47.5 | 61,47.5 61,48.25 58.75,50.5 | R5.1 62.89,47.5 61,47.5 | 44.25,32.5 43.83,32.92 U5.18 43.83,37.17 43.75,37.25 43.85,37.35 C5.1
  Top 1.27: C11.+ 50.94,34 51,34
N$1
  Top 0.203: R7.2 12.75,5.25 13,5 D1.K
N$2
  Top 0.813: R23.2 4.03,24.72 4,24.75 4.09,24.84 D5.K
N$3
  Top 0.254: R8.2 D2.K
N$4
  Top 0.254: R9.2 D3.K
N$5
  Top 0.203: U2.9 82.76,45.01 83.25,45.5
  Top 0.813: 83.25,45.5 84,45.5 84.25,45.25
  Top 1.27: L1.2 89.55,42.95 87.25,45.25 84.25,45.25
N$6
  Top 0.254: R12.2 D4.K
N$7  (via drill 0.51 pad 5.23)
  other vias: 3.54,3.54
N$8
  Top 0.203: U5.16 47,34.75 47.16,34.91 R20.1
N$9  (via drill 0.51 pad 5.23)
  other vias: 3.54,51.65
N$10
  Top 0.203: U5.15 45.5,34.25 45,34.75 45,36.25 45.51,36.76 R21.1
N$13
  Top 0.203: U1.P9 75.04,37.21 75,37.25 75.22,37.47 R24.2
N$14
  Top 0.203: U1.P8 55.81,36.94 55.37,37.38 R25.2
N$15
  Top 0.203: U6.3 28.29,29.79 28,29.5 28,28.75 27.73,28.48 U6.6 27.06,28.36 27.06,28 Q2.1 27,27.94 27,26.79 R30.1 26.67,26.39 26.69,26.38 26.67,26.36 C27.1
N$21
  Top 0.203: U6.1 28.89,28.36 29.04,28.21 | 29.04,28.21 C28.1 | 29.04,28.21 29.04,27.29 28.69,26.94 28.69,26.88 28.37,26.56 R30.2 | Q2.2 29.29,27.96 29.04,28.21
N$28
  Top 0.203: C25.2 18.58,37.83 18.5,37.75 18.39,37.86 R19.2
N$30
  Top 0.254: C17.2 17.06,28.44 17,28.5 17.13,28.63 R18.2
N$31
  Top 0.61: R15.1 8.83,49.58 10.76,51.51 C22.-
N$34
  Top 0.61: R16.1 11.5,30.23 11.5,28.52 C19.-
N$35
  Top 0.61: R15.2 8.75,47.08 8.75,46.2 J9.3
N$36
  Top 0.61: R16.2 11.54,32.71 11.21,33.04 J9.2
PC-RX
  Top 0.203: R11.2 19.3,48.95 19.25,49 19.48,49.23 J4.2
PC-TX
  Top 0.203: R2.2 21.65,48.9 22.23,49.48 J4.3
PGC
  Top 0.203: J8.5 51.16,50.34 53.75,47.75 53.75,45.25 53,44.5 46.25,44.5 44.75,43 44.75,40.25 45.51,39.49 R21.2
PGD
  Top 0.203: J8.4 53.7,49.55 54.75,48.5 54.75,45 53.25,43.5 46.75,43.5 45.75,42.5 45.75,41 47.16,39.59 R20.2
PWREN  (via drill 0.81)
  Top 0.203: SW1.5 7.05,13.2 9.25,11 9.25,5.25 12,2.5 51.25,2.5 77,28.25 v77,39 | U2.1 78.24,45.51 78,45.75 78,47 | 78,47 78,48.5 77.75,48.75 | C7.1 77.75,48.75 | R10.2 78.09,47.09 78,47 | v78,49.88 78,49 77.75,48.75
  Bottom 0.203: v77,39 v78,49.88
PWRSAVE  (via drill 0.81)
  Top 0.203: U5.64 44.8,24.95 46.75,23 46.75,21.75 48.75,19.75 v51.25,19.75 | U2.8 82.74,44.51 83.25,44 83.25,38.25 83.87,37.63 R26.2 83.91,37.34 v86.5,34.75
  Bottom 0.203: v86.5,34.75 71.25,19.75 v51.25,19.75
RB3
  Top 0.203: U5.13 48.5,33.25 49.38,34.12 49.38,41.38 49.81,41.81 J6.2
SCK1
  Top 0.203: U5.35 33,33.75 30.94,35.81 24.94,35.81 24.41,36.34 U7.3 24.41,41.84 24.27,41.98 | 24.27,41.98 24.25,42 | 24.27,41.98 R28.2
SDCS#
  Top 0.203: U5.3 47.75,28.25 48.5,27.5 48.5,26.5 49.5,25.5 67.75,25.5 72.54,30.29 U1.P1
SDO1
  Top 0.203: U5.33 34,34.75 29.81,38.94 R32.1
SDSCK  (via drill 0.81)
  Top 0.203: U1.P5 62.54,32.79 56.44,26.69 v50.69,26.69 50.31,26.69 48.25,28.75 U5.4
  Bottom 0.203: v50.69,26.69 R14.2
SDSDI  (via drill 0.81)
  Top 0.203: U5.6 45.5,29.75 45,29.25 45,27.25 48.25,24 v48.56,24 67.75,24 74,30.25 74,38.25 73.25,39 71,39 70.04,38.04 U1.P2
  Bottom 0.203: R17.2 47.48,24.02 v48.56,24
SDSDO
  Top 0.203: U5.5 48.88,29.25 50.12,28 54.75,28 57.72,30.96 U1.P7
SDVDD  (via drill 0.81)
  Top 0.61: U1.P4 65.04,38.54 65.4,38.9 C10.1 65.4,39.1 64.47,40.03 C8.+
  Top 1.016: v70.97,30.71 69.03,30.71 65.04,34.71 U1.P4
  Bottom 1.016: v70.97,30.71 R4.1
SS1#
  Top 0.203: U5.14 48,33.75 48.5,34.25 48.5,40.75 47.34,41.91 J6.1
U2RX
  Top 0.203: R2.1 24.57,48.5 D9.C 25,48.61 25,46.99 J1.3 25.74,46.25 26.25,46.25 29.25,43.25 32.5,43.25 37.33,38.42 U5.31
U2TX
  Top 0.203: U5.32 36.83,37.67 32,42.5 28.75,42.5 26.5,44.75 25,44.75 23.41,46.34 J1.4 21.16,46.34 20.35,47.15 R11.1
VBATT  (via drill 0.81)
  Top 0.203: C12.1 89.54,51.21 89.5,51.25 89.5,51.5 91,53 96.5,53 98.5,51 98.5,16.75 83.5,1.75 11.5,1.75 8.5,4.75 8.5,9.3 SW1.6 | R22.2 37.96,49.25 v47.25,49.25 | U2.7 81.99,44.01 82,44 81.97,43.97 81.75,43.97 | R26.1 82.17,36.42 82,36.25
  Top 0.254: 82,43.5 81.8,43.5 U2.6 81.78,43.5 81.75,43.5 81.75,43.97
  Top 0.61: 86,53.5 85.8,53.7 72.01,53.7 J2.3 69.31,51 69.31,50.69 v67.88,49.25
  Top 1.016: 89.11,48.39 89.28,48.22 L1.1 89.55,48.3 89.75,48.5 89.54,48.71 C12.1 | C24.1 82,41.82 82,43.5 | D8.3 87.3,52.2 86,53.5
  Top 1.27: L1.1 89.55,47.45 92.25,44.75 92.25,32.58 J5.1 89.99,32.5 85.75,32.5 82,36.25 81.95,36.3 C24.1 | C12.1 89.54,50.79 88.89,50.14 D8.3
  Bottom 0.203: v67.88,49.25 v47.25,49.25
VCOM
  Top 0.203: U7.7 21.82,37.94 21.5,38.25 21.5,39.25 C14.+
VDDCORE
  Top 0.203: C1.1 40.65,23.1 40.33,23.42 U5.56
  Top 0.61: C1.1 41.4,23.1 42.62,21.88 C9.1
(copper drawn outside any net)
  shapes: Top area x43, Top circle x2

### Text on the board
Top: * | + | + | * | + | + | * | + | + | + | * | G | + | G | G | G | c 2008 | G | K9SPUD LLC | TRAXMOD | REV 0.7.0